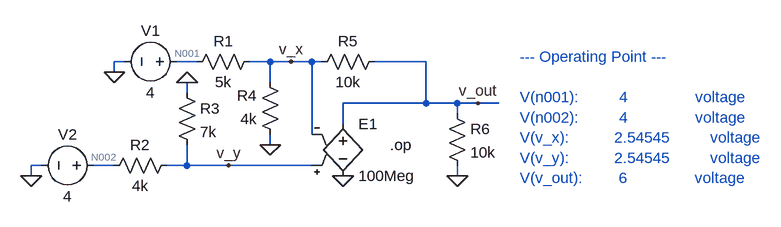
[diagram p0: schematic Q3.asc]
Q3.asc, the LTspice schematic file:
Version 4
SHEET 1 1124 680
WIRE 112 0 96 0
WIRE 224 0 192 0
WIRE 336 0 304 0
WIRE 368 0 336 0
WIRE 400 0 368 0
WIRE 416 0 400 0
WIRE 576 0 496 0
WIRE 96 16 96 0
WIRE 336 32 336 0
WIRE 208 48 208 32
WIRE 576 64 576 0
WIRE 576 64 448 64
WIRE 624 64 576 64
WIRE 656 64 624 64
WIRE 688 64 656 64
WIRE 624 80 624 64
WIRE 448 96 448 64
WIRE 400 112 400 0
WIRE 336 128 336 112
WIRE -16 160 -32 160
WIRE 96 160 64 160
WIRE 208 160 208 128
WIRE 208 160 176 160
WIRE 272 160 208 160
WIRE 400 160 272 160
WIRE -32 176 -32 160
WIRE 624 176 624 160
FLAG 448 176 0
FLAG 624 176 0
FLAG 656 64 v_out
FLAG -32 176 0
FLAG 96 16 0
FLAG 336 128 0
FLAG 208 32 0
FLAG 368 0 v_x
FLAG 272 160 v_y
SYMBOL voltage 208 0 R90
WINDOW 0 -32 56 VBottom 2
WINDOW 3 32 56 VTop 2
SYMATTR InstName V1
SYMATTR Value 4
SYMBOL voltage 80 160 R90
WINDOW 0 -32 56 VBottom 2
WINDOW 3 32 56 VTop 2
SYMATTR InstName V2
SYMATTR Value 4
SYMBOL res 320 -16 R90
WINDOW 0 0 56 VBottom 2
WINDOW 3 32 56 VTop 2
SYMATTR InstName R1
SYMATTR Value 5k
SYMBOL res 192 144 R90
WINDOW 0 0 56 VBottom 2
WINDOW 3 32 56 VTop 2
SYMATTR InstName R2
SYMATTR Value 4k
SYMBOL res 192 32 R0
SYMATTR InstName R3
SYMATTR Value 7k
SYMBOL res 352 128 R180
WINDOW 0 36 76 Left 2
WINDOW 3 36 40 Left 2
SYMATTR InstName R4
SYMATTR Value 4k
SYMBOL e2 448 80 R0
SYMATTR InstName E1
SYMATTR Value 100Meg
SYMBOL res 512 -16 R90
WINDOW 0 0 56 VBottom 2
WINDOW 3 32 56 VTop 2
SYMATTR InstName R5
SYMATTR Value 10k
SYMBOL res 608 64 R0
SYMATTR InstName R6
SYMATTR Value 10k
TEXT 520 128 Left 2 !.op
TEXT 720 -8 Left 2 ;--- Operating Point ---\n \nV(n001):         4               voltage\nV(n002):         4               voltage\nV(v_x):          2.54545         voltage\nV(v_y):          2.54545         voltage\nV(v_out):        6               voltage

The netlist it stands for:
* Q3.asc
V1 N001 0 4
V2 N002 0 4
R1 v_x N001 5k
R2 v_y N002 4k
R3 0 v_y 7k
R4 0 v_x 4k
E1 v_out 0 v_y v_x 100Meg
R5 v_out v_x 10k
R6 v_out 0 10k
.op
* --- Operating Point ---
* V(n001):         4               voltage
* V(n002):         4               voltage
* V(v_x):          2.54545         voltage
* V(v_y):          2.54545         voltage
* V(v_out):        6               voltage
.backanno
.end

* Results of the author's LTspice run, read from the files saved beside the schematic
* Operating Point:
*   V(n001) = 4 V
*   V(n002) = 4 V
*   V(v_x) = 2.545 V
*   V(v_y) = 2.545 V
*   V(v_out) = 6 V
*   I(R1) = -290.9 µA
*   I(R2) = -363.6 µA
*   I(R3) = -363.6 µA
*   I(R4) = -636.4 µA
*   I(R5) = 345.5 µA
*   I(R6) = 600 µA
*   I(E1) = -945.5 µA
*   I(V1) = -290.9 µA
*   I(V2) = -363.6 µA